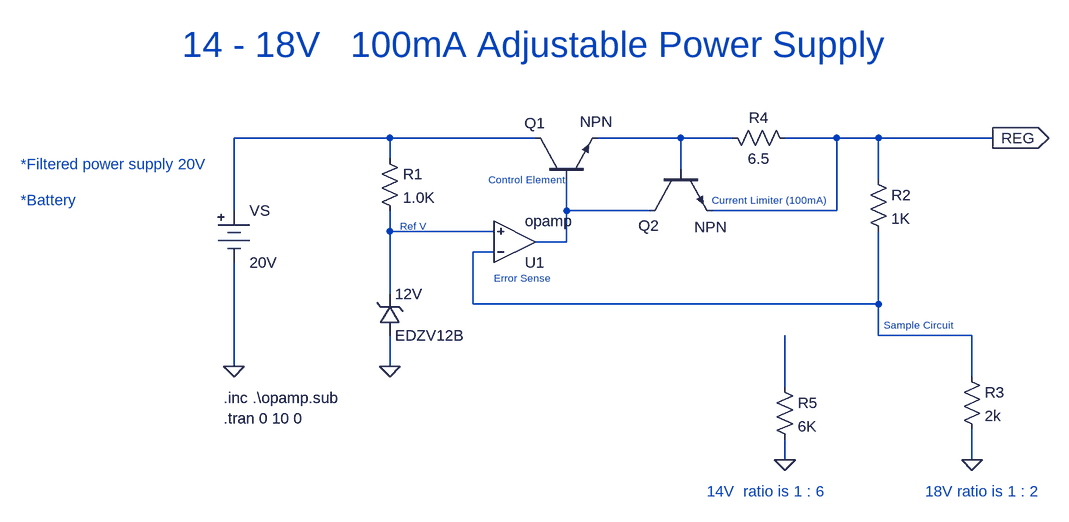
[diagram p0: schematic Power supply Helios.asc]
Power supply Helios.asc, the LTspice schematic file:
Version 4
SHEET 1 1896 680
WIRE 48 0 -192 0
WIRE 272 0 48 0
WIRE 496 0 368 0
WIRE 576 0 496 0
WIRE 736 0 656 0
WIRE 800 0 736 0
WIRE 976 0 800 0
WIRE 48 32 48 0
WIRE 496 48 496 0
WIRE 800 64 800 0
WIRE -192 112 -192 0
WIRE 320 112 320 64
WIRE 448 112 320 112
WIRE 736 112 736 0
WIRE 736 112 544 112
WIRE 48 144 48 112
WIRE 208 144 48 144
WIRE 320 160 320 112
WIRE 320 160 272 160
WIRE 208 176 176 176
WIRE 48 240 48 144
WIRE 176 256 176 176
WIRE 800 256 800 144
WIRE 800 256 176 256
WIRE 800 304 800 256
WIRE 944 304 800 304
WIRE -192 352 -192 192
WIRE 48 352 48 304
WIRE 944 368 944 304
WIRE 656 384 656 304
WIRE 656 496 656 464
WIRE 944 496 944 448
FLAG -192 352 0
FLAG 48 352 0
FLAG 944 496 0
FLAG 976 0 REG
IOPIN 976 0 Out
FLAG 656 496 0
SYMBOL Opamps\\opamp 240 224 M180
SYMATTR InstName U1
SYMBOL npn 272 64 R270
WINDOW 0 87 -17 VRight 2
WINDOW 3 89 69 VRight 2
SYMATTR InstName Q1
SYMBOL res 32 16 R0
SYMATTR InstName R1
SYMATTR Value 1.0K
SYMBOL zener 32 304 M180
WINDOW 0 24 64 Left 2
WINDOW 3 24 0 Left 2
SYMATTR InstName 12V
SYMATTR Value EDZV12B
SYMATTR Description Diode
SYMATTR Type diode
SYMBOL res 784 48 R0
SYMATTR InstName R2
SYMATTR Value 1K
SYMBOL res 928 352 R0
SYMATTR InstName R3
SYMATTR Value 2k
SYMBOL Misc\\battery -192 96 R0
WINDOW 123 0 0 Left 2
WINDOW 39 0 0 Left 2
SYMATTR InstName VS
SYMATTR Value 20V
SYMBOL npn 448 48 M90
WINDOW 0 87 -17 VRight 2
WINDOW 3 89 69 VRight 2
SYMATTR InstName Q2
SYMBOL res 560 -16 M90
WINDOW 0 0 56 VBottom 2
WINDOW 3 32 56 VTop 2
SYMATTR InstName R4
SYMATTR Value 6.5
SYMBOL res 640 368 R0
SYMATTR InstName R5
SYMATTR Value 6K
TEXT -208 432 Left 2 !.tran 0 10 0
TEXT -208 400 Left 2 !.inc .\\opamp.sub
TEXT 536 544 Left 2 ;14V  ratio is 1 : 6
TEXT 872 544 Left 2 ;18V ratio is 1 : 2
TEXT 544 96 Left 1 ;Current Limiter (100mA)
TEXT 208 216 Left 1 ;Error Sense
TEXT 64 136 Left 1 ;Ref V
TEXT 200 64 Left 1 ;Control Element
TEXT 808 288 Left 1 ;Sample Circuit
TEXT -520 40 Left 2 ;*Filtered power supply 20V
TEXT -520 96 Left 2 ;*Battery
TEXT -272 -144 Left 5 ;14 - 18V   100mA Adjustable Power Supply

The netlist it stands for:
* Power supply Helios.asc
XU1 N005 N004 N003 opamp Aol=100K GBW=10Meg  ; pins invin noninvin out
Q1 N001 N003 N002 0 NPN
R1 N001 N004 1.0K
D§12V 0 N004 EDZV12B
R2 REG N005 1K
R3 N005 0 2k
VS N001 0 20V
Q2 N003 N002 REG 0 NPN
R4 N002 REG 6.5
R5 N006 0 6K
.model D D
.lib standard.dio
.model NPN NPN
.model PNP PNP
.lib standard.bjt
.tran 0 10 0
.inc .\opamp.sub
* 14V  ratio is 1 : 6
* 18V ratio is 1 : 2
* Current Limiter (100mA)
* Error Sense
* Ref V
* Control Element
* Sample Circuit
* *Filtered power supply 20V
* *Battery
* 14 - 18V   100mA Adjustable Power Supply
.backanno
.end